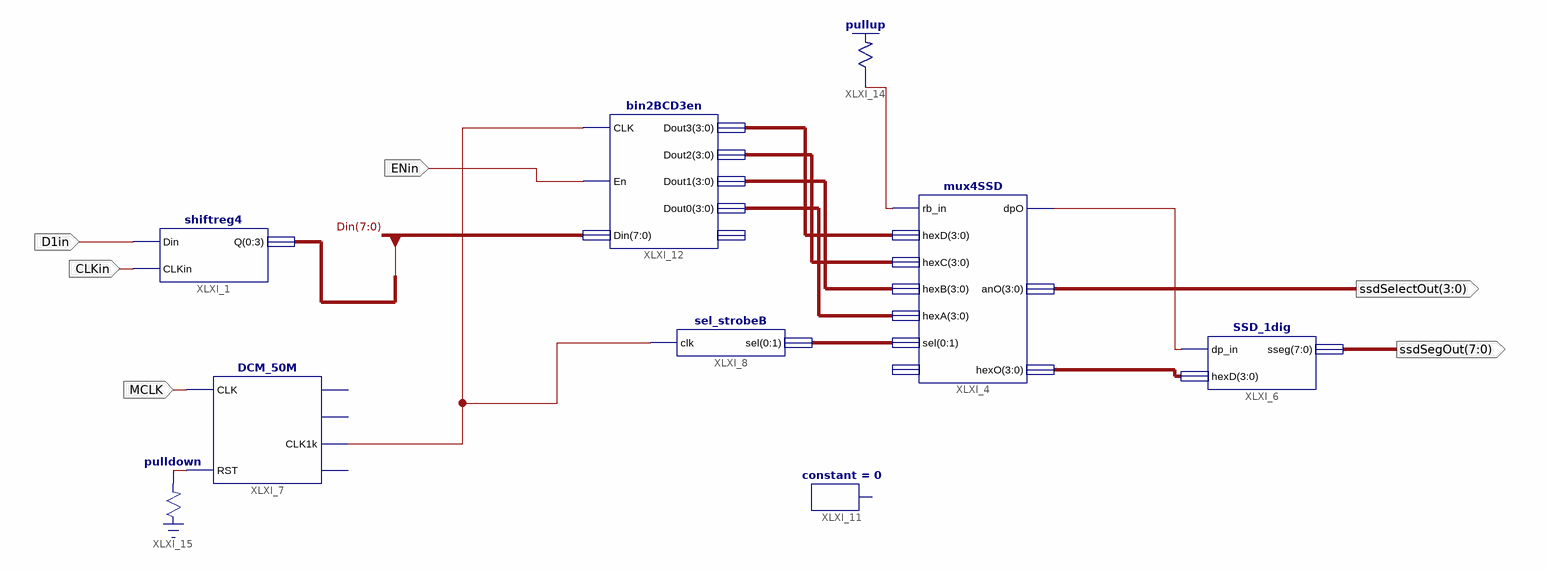
[diagram p0: schematic sheet 1]
// Xilinx ISE schematic experiment6.sch (spartan3e) as structural Verilog: 9 symbols, 6 ports
module experiment6 (
  input  D1in,
  input  MCLK,
  input  ENin,
  input  CLKin,
  output [3:0] ssdSelectOut,
  output [7:0] ssdSegOut
);

  wire XLXN_22, XLXN_25, XLXN_29, XLXN_46;
  wire [1:0] XLXN_24;
  wire [3:0] XLXN_30, XLXN_37, XLXN_38, XLXN_39, XLXN_40;
  wire [7:0] Din;

  shiftreg4 XLXI_1 (.Din(D1in), .CLKin(CLKin), .Q(Din[3:0]));
  mux4SSD XLXI_4 (
    .rb_in(XLXN_25), .hexD(XLXN_40), .hexC(XLXN_39), .hexB(XLXN_38), .hexA(XLXN_37), .sel(XLXN_24),
    .dpO(XLXN_29), .anO(ssdSelectOut), .hexO(XLXN_30));  // open: dp_in
  SSD_1dig XLXI_6 (.dp_in(XLXN_29), .hexD(XLXN_30), .sseg(ssdSegOut));
  DCM_50M XLXI_7 (.CLK(MCLK), .RST(XLXN_22), .CLK1k(XLXN_46));  // open: CLK1M, CLK10k, CLK1
  sel_strobeB XLXI_8 (.clk(XLXN_46), .sel(XLXN_24));
  constant #(.CValue("0")) XLXI_11 ();  // open: O
  bin2BCD3en XLXI_12 (
    .CLK(XLXN_46), .En(ENin), .Din(Din), .Dout3(XLXN_40), .Dout2(XLXN_39), .Dout1(XLXN_38), .Dout0(XLXN_37));  // open: RBout
  \pullup  XLXI_14 (.O(XLXN_25));
  \pulldown  XLXI_15 (.O(XLXN_22));
endmodule
